# Altium schematic sheet POWR0007_BCR_Overview.SchDoc: BCR Overview
size A3; Engineer: T. Fisk; DocumentNumber: POWR0007; SheetNumber: 1; SheetTotal: 1; Description: Structure for Battery Charge Regulators; Version: 1.0; DocumentName: BCR Overview
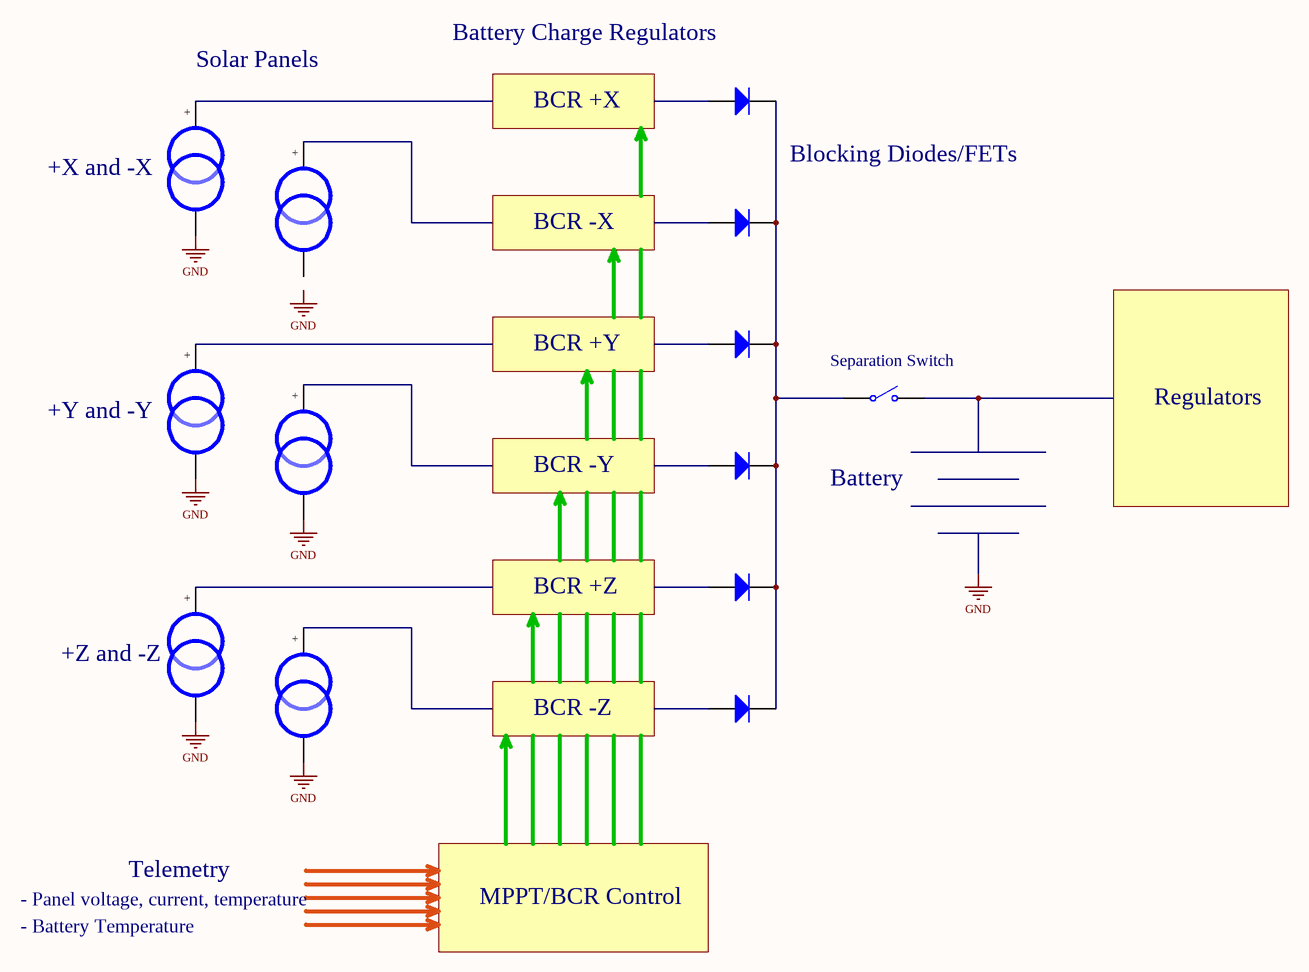
[diagram p0: POWR0007_BCR_Overview.SchDoc]

## Parts
(Parts that share a designator on the sheet are numbered #1, #2 ... from top to bottom, then left to right.)
*#1  Solar Panel  (value not drawn)
*#2  Solar Panel  (value not drawn)
*#3  Solar Panel  (value not drawn)
*#4  Solar Panel  (value not drawn)
*#5  Solar Panel  (value not drawn)
*#6  Solar Panel  (value not drawn)
D?#1  Diode  [SMC]  (value not drawn)
D?#2  Diode  [SMC]  (value not drawn)
D?#3  Diode  [SMC]  (value not drawn)
D?#4  Diode  [SMC]  (value not drawn)
D?#5  Diode  [SMC]  (value not drawn)
D?#6  Diode  [SMC]  (value not drawn)
Separation_Switch  SW-SPST  [SPST-2]  (value not drawn)

## Nets
GND: *#1.2 *#3.2 *#4.2 *#5.2 *#6.2
NetD?#1_2: D?#1.2(K) D?#2.2(K) D?#3.2(K) D?#4.2(K) D?#5.2(K) D?#6.2(K) Separation_Switch.1(COMMON)

Not connected (* = marked no-connect by the designer): *#1 +(1); *#2 2 +(1); *#3 +(1); *#4 +(1); *#5 +(1); *#6 +(1); D?#1 1(A); D?#2 1(A); D?#3 1(A); D?#4 1(A); D?#5 1(A); D?#6 1(A); Separation_Switch 2(NO)

## Notes on the sheet
- Battery Charge Regulators
- Solar Panels
- BCR +X
- (near *#1) +X and -X
- Blocking Diodes/FETs
- BCR -X
- BCR +Y
- (near *#3) +Y and -Y
- Regulators
- BCR -Y
- Battery
- BCR +Z
- (near *#5) +Z and -Z
- BCR -Z
- - Panel voltage, current, temperature
- - Battery Temperature
- Telemetry
- MPPT/BCR Control
- Labels drawn without touching a wire or pin: GND
- Title
- Description:
- Size:
- Author:
- Date:
- A3
- Time:
- Version
- Sheet:
- Drawing No.:
- of
- File:

## Library data of the parts
D?#1-D?#6 = Diode: Default Diode; Published: 8-Jun-2000; LatestRevisionDate: 17-Jul-2002; LatestRevisionNote: Re-released for DXP Platform.; PackageVersion: Sep-1996; PackageReference: SMC; Publisher: Altium Limited; PackageDescription: DO-214-AB/SMC; 2 C-Bend Leads; Body 7.9 x 5.9 mm, inc. leads (LxW); Code_JEDEC: DO-214-AB
Separation_Switch = SW-SPST: Single-Pole, Single-Throw Switch; Published: 24-Mar-1999; LatestRevisionDate: 17-Jul-2002; LatestRevisionNote: Re-released for DXP Platform.; PackageReference: SPST-2; Publisher: Altium Limited; PackageDescription: Switch; 2 Leads